# EasyEDA Pro project ProProject_工科大_2023-11-10.epro, schematic power
Create Date: 2023-09-30; Page Name: P1; Project Name: 工科大; Schematic Name: power; Update Date: 2023-10-14; Company: 嘉立创EDA; Page Size: A4; Version: V1.0
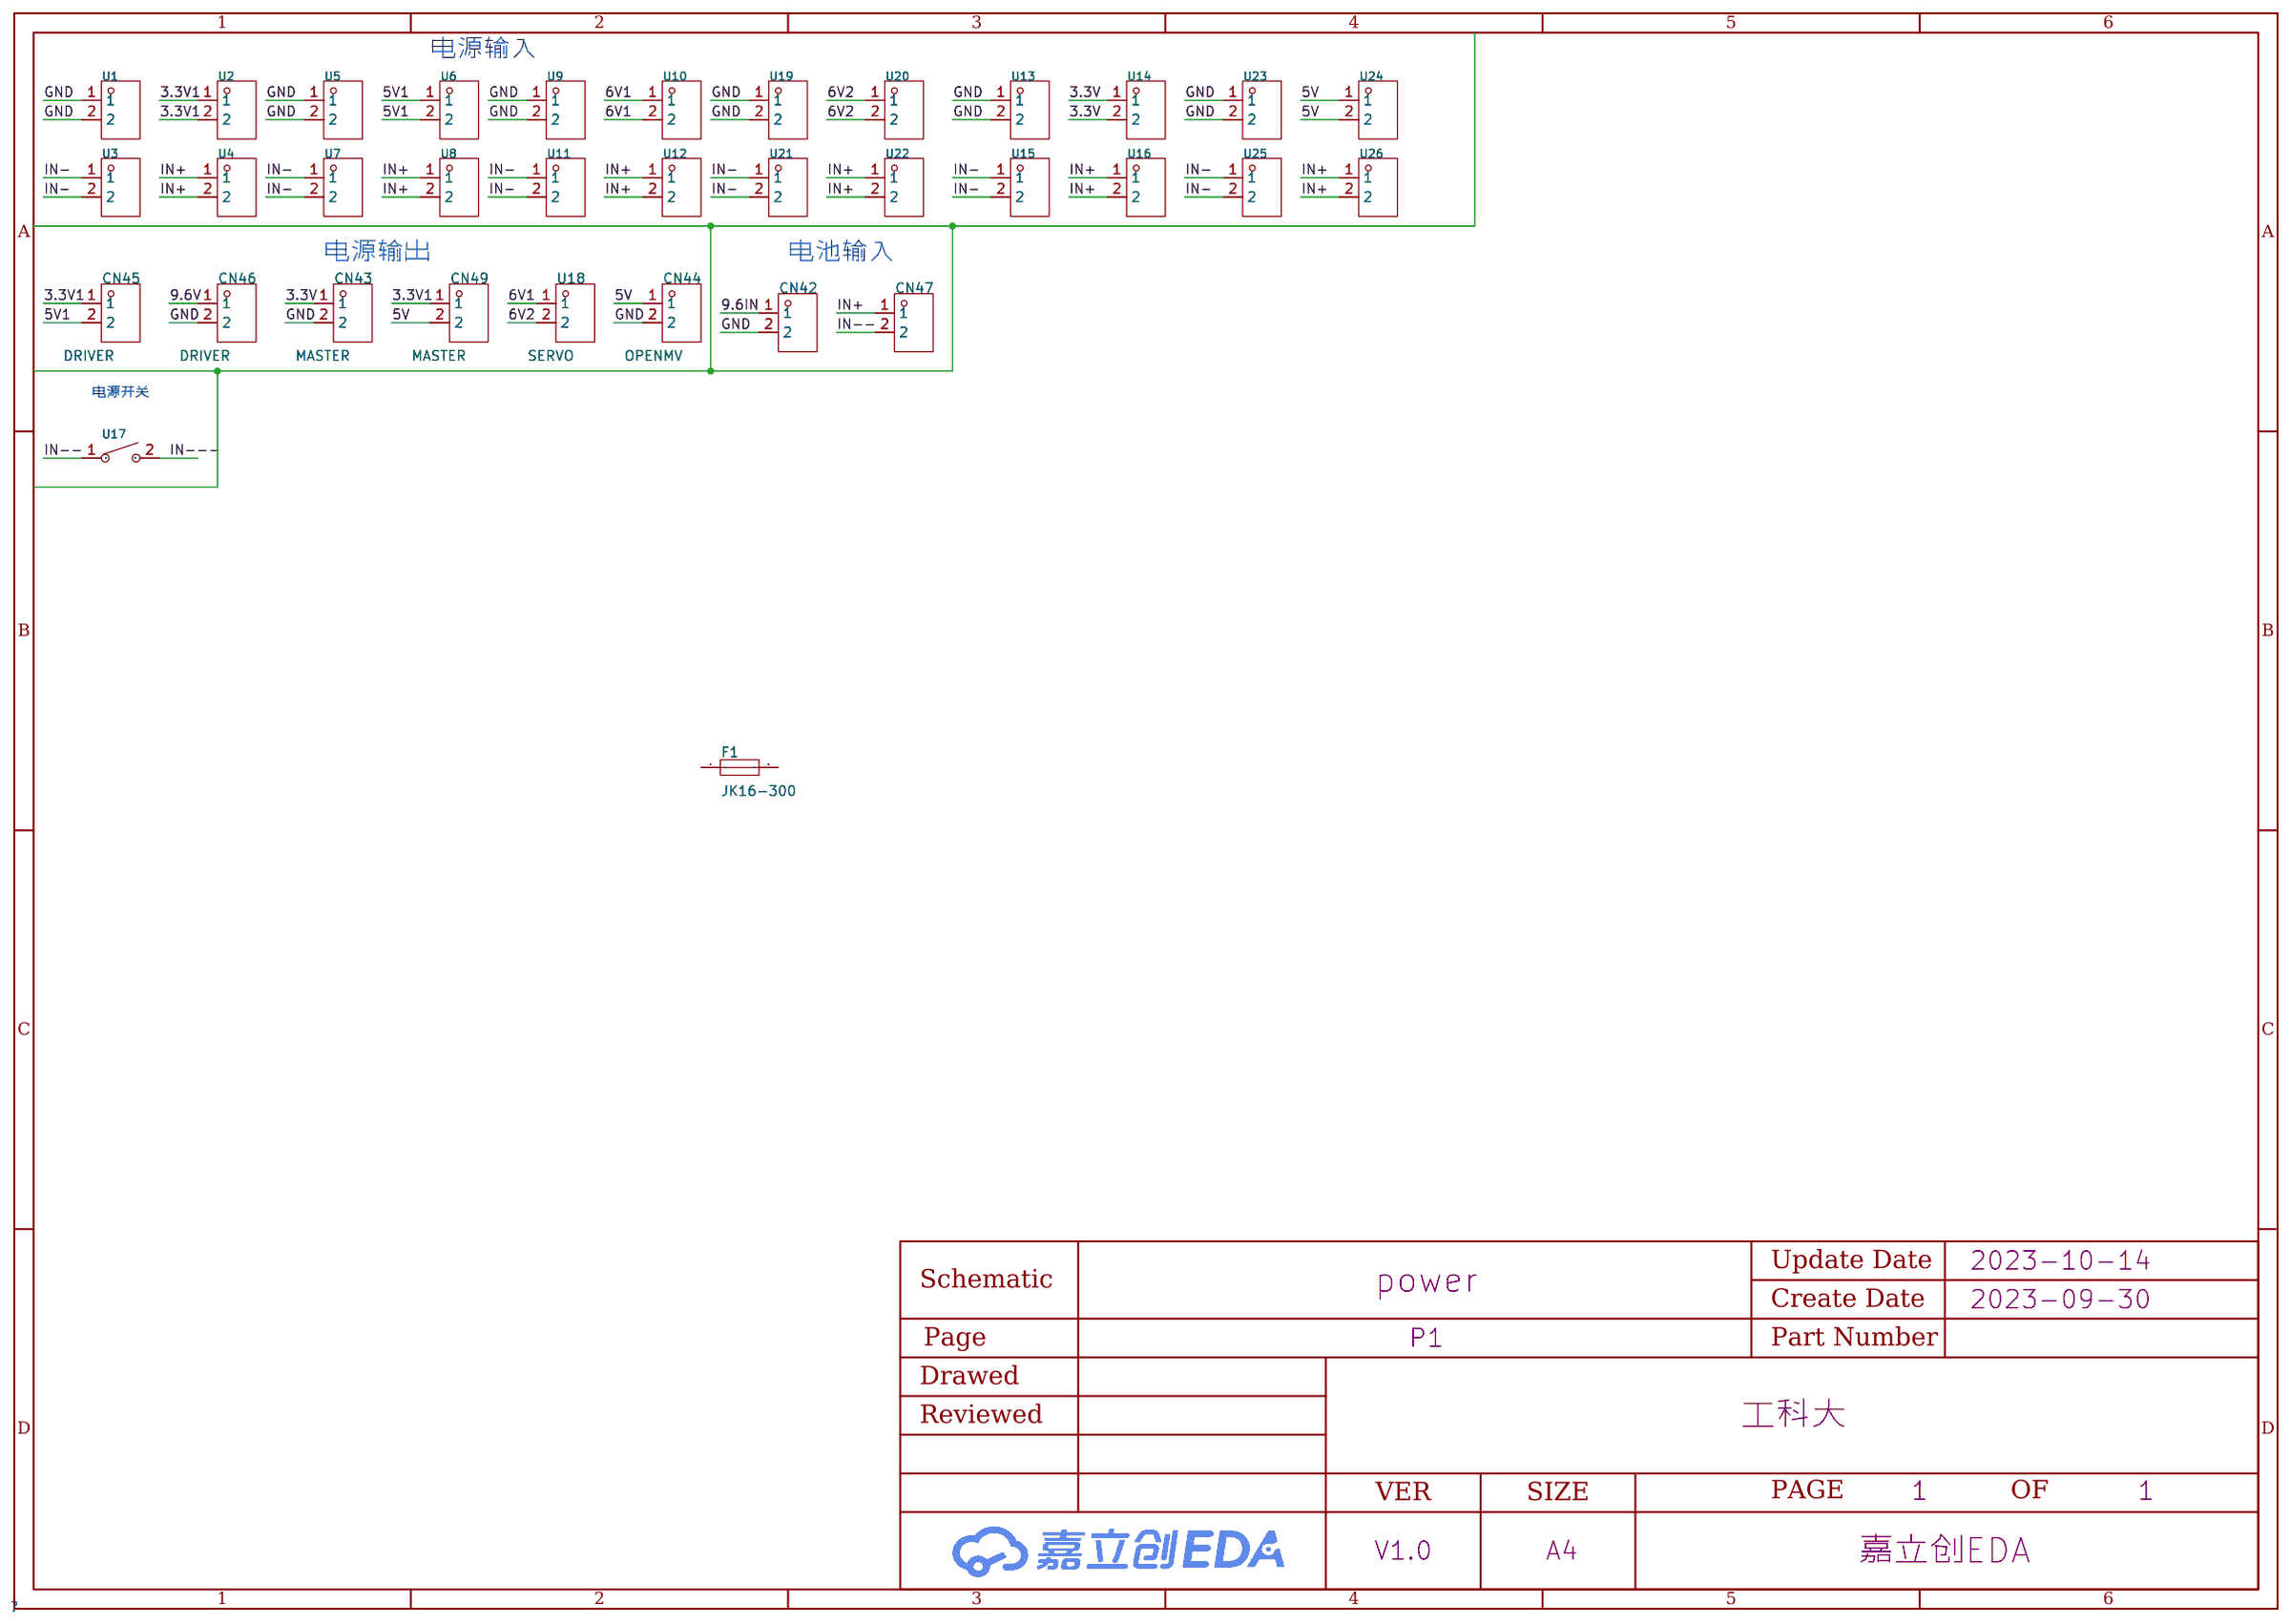
[diagram p0: schematic sheet]

## Parts
CN42  XH-2AW  [CONN-TH_XH-2AW_C2908611]
CN43  MASTER  [CONN-TH_XH-2AW_C2908611]
CN44  OPENMV  [CONN-TH_XH-2AW_C2908611]
CN45  DRIVER  [CONN-TH_XH-2AW_C2908611]
CN46  DRIVER  [CONN-TH_XH-2AW_C2908611]
CN47  XH-2AW  [CONN-TH_XH-2AW_C2908611]
CN49  MASTER  [CONN-TH_XH-2AW_C2908611]
F1  JK16-300  [FUSE-TH_L7.4-W3.1-P5.08-D1.2]
U1  PM254-1-02-Z-8.5  [HDR-TH_2P-P2.54-V-F]
U2  PM254-1-02-Z-8.5  [HDR-TH_2P-P2.54-V-F]
U3  PM254-1-02-Z-8.5  [HDR-TH_2P-P2.54-V-F]
U4  PM254-1-02-Z-8.5  [HDR-TH_2P-P2.54-V-F]
U5  PM254-1-02-Z-8.5  [HDR-TH_2P-P2.54-V-F]
U6  PM254-1-02-Z-8.5  [HDR-TH_2P-P2.54-V-F]
U7  PM254-1-02-Z-8.5  [HDR-TH_2P-P2.54-V-F]
U8  PM254-1-02-Z-8.5  [HDR-TH_2P-P2.54-V-F]
U9  PM254-1-02-Z-8.5  [HDR-TH_2P-P2.54-V-F]
U10  PM254-1-02-Z-8.5  [HDR-TH_2P-P2.54-V-F]
U11  PM254-1-02-Z-8.5  [HDR-TH_2P-P2.54-V-F]
U12  PM254-1-02-Z-8.5  [HDR-TH_2P-P2.54-V-F]
U13  PM254-1-02-Z-8.5  [HDR-TH_2P-P2.54-V-F]
U14  PM254-1-02-Z-8.5  [HDR-TH_2P-P2.54-V-F]
U15  PM254-1-02-Z-8.5  [HDR-TH_2P-P2.54-V-F]
U16  PM254-1-02-Z-8.5  [HDR-TH_2P-P2.54-V-F]
U17  电源开关  [SW-TH_RS601A-1010013BB]
U18  SERVO  [CONN-TH_XH-2AW_C2908611]
U19  PM254-1-02-Z-8.5  [HDR-TH_2P-P2.54-V-F]
U20  PM254-1-02-Z-8.5  [HDR-TH_2P-P2.54-V-F]
U21  PM254-1-02-Z-8.5  [HDR-TH_2P-P2.54-V-F]
U22  PM254-1-02-Z-8.5  [HDR-TH_2P-P2.54-V-F]
U23  PM254-1-02-Z-8.5  [HDR-TH_2P-P2.54-V-F]
U24  PM254-1-02-Z-8.5  [HDR-TH_2P-P2.54-V-F]
U25  PM254-1-02-Z-8.5  [HDR-TH_2P-P2.54-V-F]
U26  PM254-1-02-Z-8.5  [HDR-TH_2P-P2.54-V-F]

## Library data of the parts
CN42-CN47 CN49 U18 = XH-2AW_C2908611: 参考系列:XH;间距:2.54mm;插针结构:1x2P;排数:1;每排PIN数:2;行距:-;公母:公型插针;安装方式:弯插;额定电流:3A;工作温度范围:-25℃~+85℃;; LCSC Part Name: XH 2.54mm 1x2P 弯插; Supplier Part: C2908611; Manufacturer: HCTL(华灿天禄); Supplier Footprint: 弯插,P=2.54mm; JLCPCB Part Class: 扩展库; Datasheet: https://atta.szlcsc.com/upload/public/pdf/source/20211021/ACA2D54D99493880102FCACAC8DAABA8.pdf; Supplier: LCSC; Reference Series: XH; Pitch: 2.54mm; Pins Structure: 1x2P; Number of Rows: 1; Number of PINs Per Row: 2; Gender: 公型插针; Mounting Style: 弯插; Current Rating (Max): 3A; Operating Temperature Range: -25℃~+85℃
F1 = JK16-300_C369115: 最大电压:16V;最大电流:100A;保持电流:3A;跳闸电流:6A;最大动作时间:15s;; LCSC Part Name: 16V 3A 自恢复保险丝; Supplier Part: C369115; Manufacturer: JK(金科); Supplier Footprint: 插件; JLCPCB Part Class: 扩展库; Datasheet: https://atta.szlcsc.com/upload/public/pdf/source/20190402/C369115_628002D21EFCC0EFF869ED64EF075328.pdf; Supplier: LCSC; Operating Voltage (Max): 16V; Current Rating (Max): 100A; Hold Current: 3A; Trip Current: 6A; Maximum Time to Trip: 15s
U1-U16 U19-U26 = PM254-1-02-Z-8.5: 排数:单排;总孔位数:2P;间距:2.54mm;插孔结构:1x2P;行距:-;安装类型:直插;圆孔/方孔:方孔;额定电流:3A;额定电压:-;插孔方向:顶部;塑高:8.5mm;工作温度范围:-40℃~+105℃;; LCSC Part Name: 2.54mm 1x2P; Supplier Part: C2897365; Manufacturer: HCTL(华灿天禄); Supplier Footprint: 插件,P=2.54mm; JLCPCB Part Class: 扩展库; Datasheet: https://atta.szlcsc.com/upload/public/pdf/source/20230609/534BE42964C679BDE98E061007C4ABD6.pdf; Supplier: LCSC; Number of Rows: 单排; Number of Holes: 2P; Pitch: 2.54mm; Holes Structure: 1x2P; Mounting Type: 直插; Circular Hole / Square Hole: 方孔; Current Rating (Max): 3A; Holes Direction: 顶部; Insulation Height: 8.5mm; Operating Temperature Range: -40℃~+105℃
U17 = RS601A-1010013BB: 额定电流：6A 额定电压(AC)：250V 电路结构：单刀单掷 机械寿命：10000 翘板形状：凹面弯曲 翘板颜色：黑色 翘板标志：| O 带灯：无 引脚样式：焊片 工作温度：-25℃~+85℃ 开关长度：21mm 开关宽度：15mm 开关高度：13.6mm; LCSC Part Name: 弯脚船型开关; Supplier Part: C5124217; Manufacturer: HCTL(华灿天禄); Supplier Footprint: 插件; Datasheet: https://atta.szlcsc.com/upload/public/pdf/source/20230703/4B37802243C6D02ECBD985ACB2856989.pdf; Supplier: LCSC

## Nets
3.3V: CN43.1 U14.1 U14.2
3.3V1: CN45.1 CN49.1 U2.1 U2.2
5V: CN44.1 CN49.2 U24.1 U24.2
5V1: CN45.2 U6.1 U6.2
6V1: U10.1 U10.2 U18.1
6V2: U18.2 U20.1 U20.2
9.6V: CN46.1
GND: CN42.2 CN43.2 CN44.2 CN46.2 U1.1 U1.2 U5.1 U5.2 U9.1 U9.2 U13.1 U13.2 U19.1 U19.2 U23.1 U23.2
9.6IN: CN42.1
IN+: CN47.1 U4.1 U4.2 U8.1 U8.2 U12.1 U12.2 U16.1 U16.2 U22.1 U22.2 U26.1 U26.2
IN-: U3.1 U3.2 U7.1 U7.2 U11.1 U11.2 U15.1 U15.2 U21.1 U21.2 U25.1 U25.2
IN--: CN47.2 U17.1
IN---: U17.2

Not connected (* = marked no-connect by the designer): F1 1 2

## Notes on the sheet
- 电源输入
- 电源输出
- 电池输入
- 电源开关
